# Altium schematic sheet Tray 1 Expansion Board Prototype.SchDoc
size A4
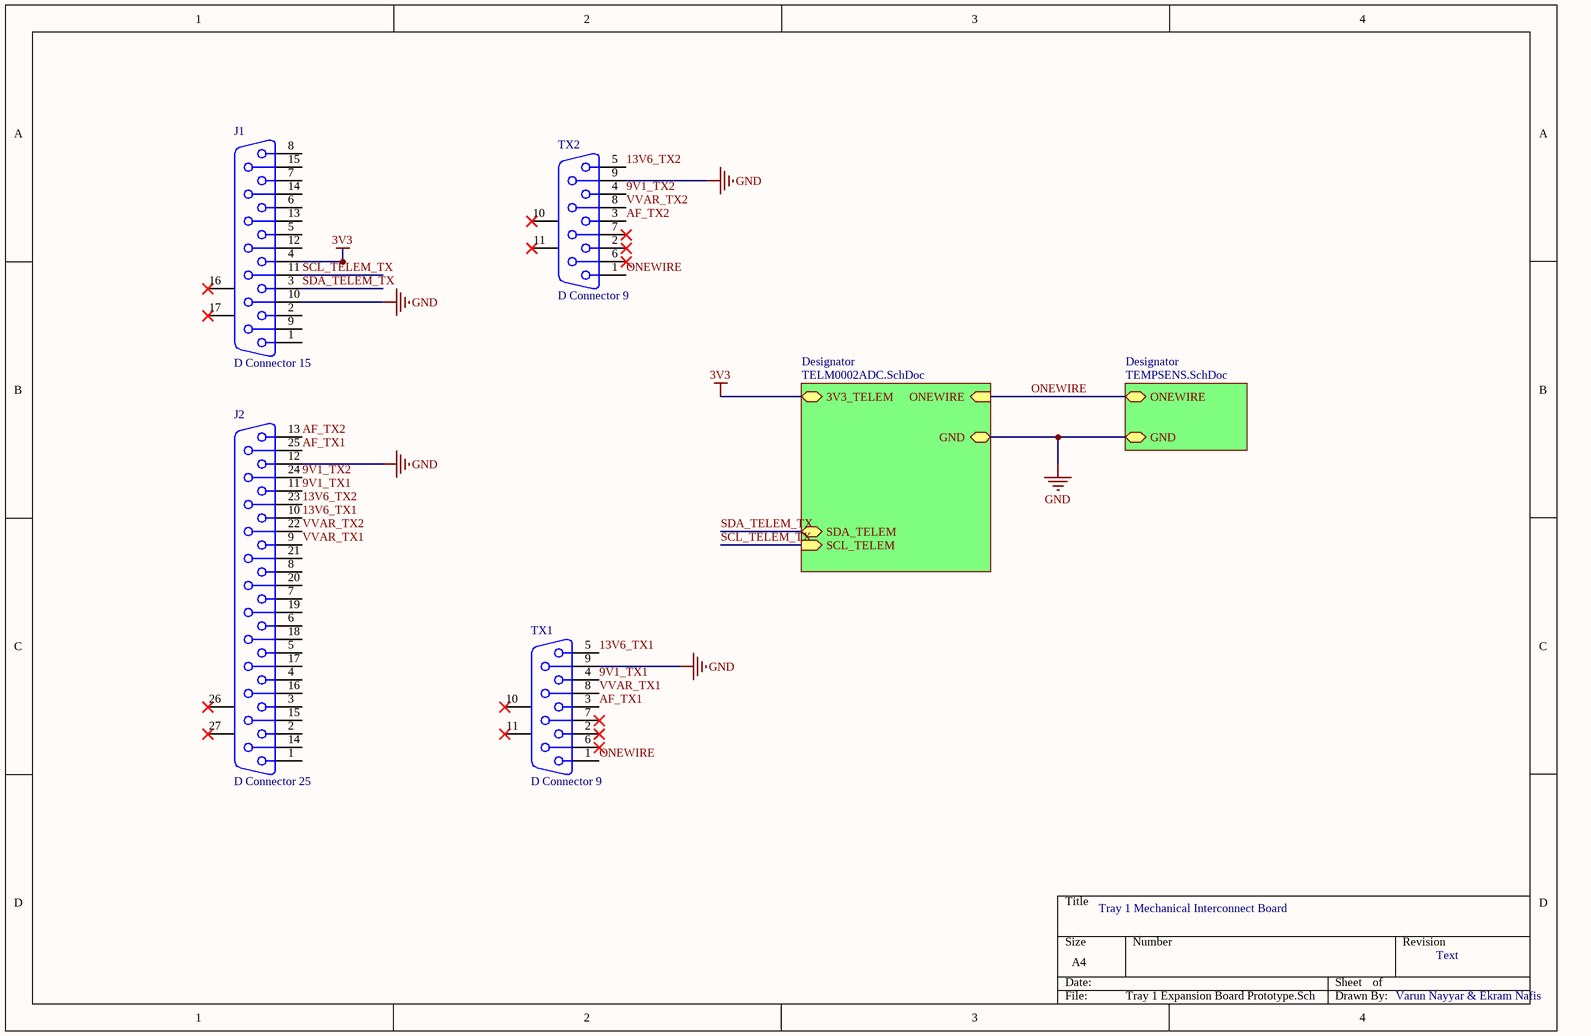
[diagram p0: Tray 1 Expansion Board Prototype.SchDoc]

## Parts
J1  D Connector 15  [DSUB1.385-2H15]
J2  D Connector 25  [DSUB1.385-2H25A]
TX1  D Connector 9  [DSUB Upright]
TX2  D Connector 9  [DSUB Upright]

## Sub-sheets
Designator = TELM0002ADC.SchDoc: SDA_TELEM (bidir), SCL_TELEM (in), ONEWIRE (in), 3V3_TELEM, GND
Designator = TEMPSENS.SchDoc: GND, ONEWIRE (bidir)

## Nets
3V3: J1.4 ; sheet Designator/3V3_TELEM
GND: J1.10 J2.12 TX1.9 TX2.9 ; sheet Designator/GND, sheet Designator/GND
9V1_TX1: J2.11 TX1.4
9V1_TX2: J2.24 TX2.4
13V6_TX1: J2.10 TX1.5
13V6_TX2: J2.23 TX2.5
AF_TX1: J2.25 TX1.3
AF_TX2: J2.13 TX2.3
ONEWIRE: TX1.1 TX2.1 ; sheet Designator/ONEWIRE, sheet Designator/ONEWIRE
SCL_TELEM_TX: J1.11 ; sheet Designator/SCL_TELEM
SDA_TELEM_TX: J1.3 ; sheet Designator/SDA_TELEM
VVAR_TX1: J2.9 TX1.8
VVAR_TX2: J2.22 TX2.8

Not connected (* = marked no-connect by the designer): J1 1 2 5 6 7 8 9 12 13 14 15 16(MH1)* 17(MH2)*; J2 1 2 3 4 5 6 7 8 14 15 16 17 18 19 20 21 26(MH1)* 27(MH2)*; TX1 2* 6* 7* 10(MH1)* 11(MH2)*; TX2 2* 6* 7* 10(MH1)* 11(MH2)*

## Notes on the sheet
- Tray 1 Mechanical Interconnect Board
- Text
- Varun Nayyar & Ekram Nafis

## Library data of the parts
J1 = D Connector 15: Receptacle Assembly, 15 Position, Right Angle; Supplier: TBD; Supplier P/N: TBD
J2 = D Connector 25: Receptacle Assembly, 25 Position, Right Angle; Supplier: TBD; Supplier P/N: TBD
TX1 TX2 = D Connector 9: Receptacle Assembly, 9 Position, Right Angle; Supplier: TBD; Supplier P/N: TBD